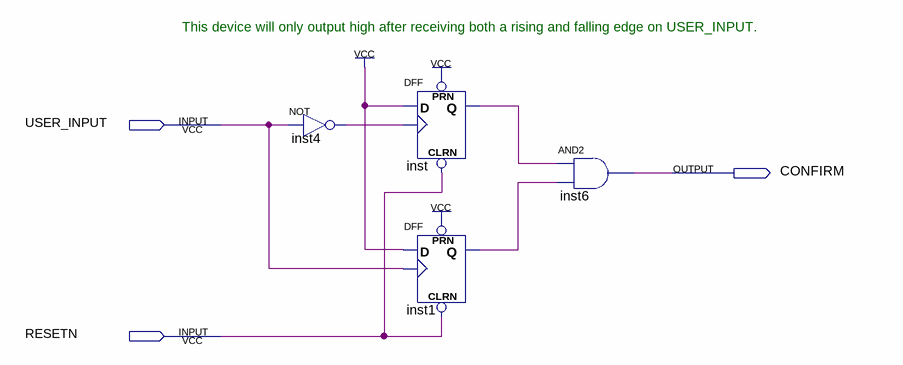
[diagram p0: schematic sheet]
// Quartus schematic SAFETY_ENABLE.bdf as structural Verilog: 4 symbols, 3 pins
module SAFETY_ENABLE (
  input  USER_INPUT,
  input  RESETN,
  output CONFIRM
);

  wire inst1_q, inst4_out, inst_q;

  not inst4 (inst4_out, USER_INPUT);
  DFF inst (.CLRN(RESETN), .CLK(inst4_out), .D(1'b1), .PRN(1'b1), .Q(inst_q));
  DFF inst1 (.CLRN(RESETN), .CLK(USER_INPUT), .D(1'b1), .PRN(1'b1), .Q(inst1_q));
  and inst6 (CONFIRM, inst_q, inst1_q);

  // Notes on the sheet:
  //   This device will only output high after receiving both a rising and falling edge on USER_INPUT.
endmodule
